# EAGLE design display (EAGLE 5.07)
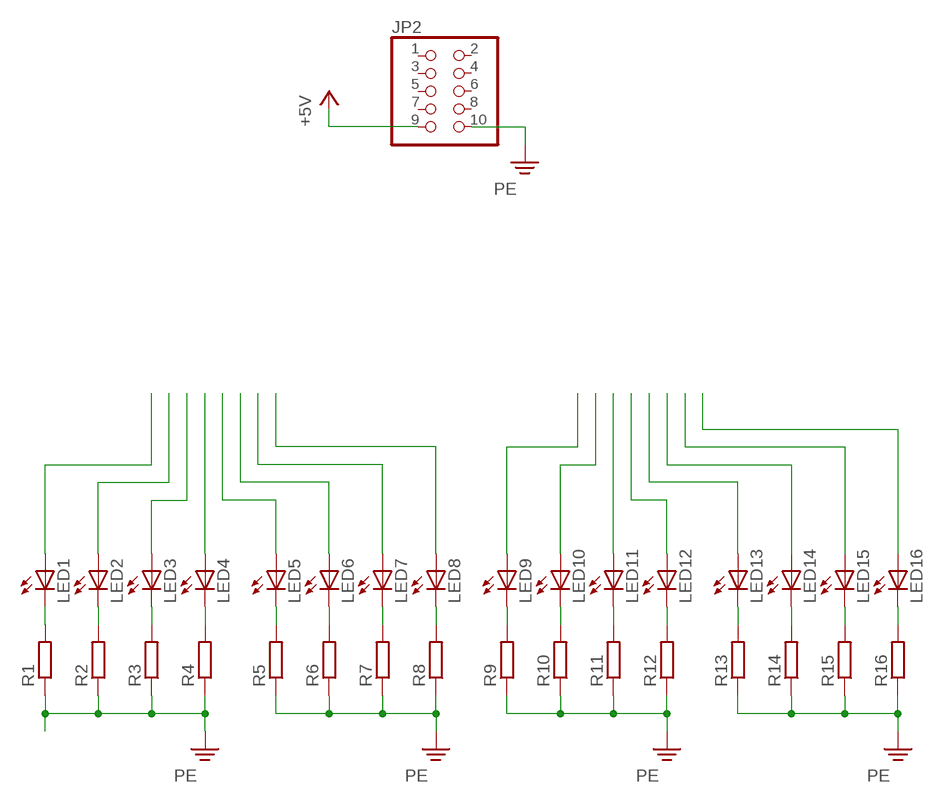
[diagram p0: schematic, sheet 1]

## Parts
JP2  PINHD-2X5  [2X05]
LED1  LED3MM  [LED3MM]
LED2  LED3MM  [LED3MM]
LED3  LED3MM  [LED3MM]
LED4  LED3MM  [LED3MM]
LED5  LED3MM  [LED3MM]
LED6  LED3MM  [LED3MM]
LED7  LED3MM  [LED3MM]
LED8  LED3MM  [LED3MM]
LED9  LED3MM  [LED3MM]
LED10  LED3MM  [LED3MM]
LED11  LED3MM  [LED3MM]
LED12  LED3MM  [LED3MM]
LED13  LED3MM  [LED3MM]
LED14  LED3MM  [LED3MM]
LED15  LED3MM  [LED3MM]
LED16  LED3MM  [LED3MM]
R1  R-EU_0207/10  [0207/10]
R2  R-EU_0207/10  [0207/10]
R3  R-EU_0207/10  [0207/10]
R4  R-EU_0207/10  [0207/10]
R5  R-EU_0207/10  [0207/10]
R6  R-EU_0207/10  [0207/10]
R7  R-EU_0207/10  [0207/10]
R8  R-EU_0207/10  [0207/10]
R9  R-EU_0207/10  [0207/10]
R10  R-EU_0207/10  [0207/10]
R11  R-EU_0207/10  [0207/10]
R12  R-EU_0207/10  [0207/10]
R13  R-EU_0207/10  [0207/10]
R14  R-EU_0207/10  [0207/10]
R15  R-EU_0207/10  [0207/10]
R16  R-EU_0207/10  [0207/10]

## Nets
+5V: JP2.9
N$1: LED1.K(C) R1.2
N$2: LED2.K(C) R2.2
N$5: LED3.K(C) R3.2
N$6: LED4.K(C) R4.2
N$12: LED5.K(C) R5.2
N$13: LED6.K(C) R6.2
N$14: LED7.K(C) R7.2
N$15: LED8.K(C) R8.2
N$17: LED9.K(C) R9.2
N$18: LED10.K(C) R10.2
N$19: LED11.K(C) R11.2
N$20: LED12.K(C) R12.2
N$21: LED13.K(C) R13.2
N$22: LED14.K(C) R14.2
N$23: LED15.K(C) R15.2
N$24: LED16.K(C) R16.2
N$27: LED1.A
N$28: LED2.A
N$29: LED3.A
N$30: LED4.A
N$31: LED5.A
N$32: LED6.A
N$33: LED7.A
N$34: LED8.A
N$35: LED9.A
N$36: LED10.A
N$37: LED11.A
N$38: LED12.A
N$39: LED13.A
N$40: LED14.A
N$41: LED15.A
N$42: LED16.A
PE: JP2.10 R1.1 R2.1 R3.1 R4.1 R5.1 R6.1 R7.1 R8.1 R9.1 R10.1 R11.1 R12.1 R13.1 R14.1 R15.1 R16.1
Unconnected: JP2.1 JP2.2 JP2.3 JP2.4 JP2.5 JP2.6 JP2.7 JP2.8

## Library data of the parts
JP2 = pinhead:PINHD-2X5: PIN HEADER
LED1-LED16 = led:LED: LED OSRAM: - CHIPLED LG R971, LG N971, LY N971, LG Q971, LY Q971, LO R971, LY R971 LH N974, LH R974 LS Q976, LO Q976, LY Q976 LO Q996 - Hyper CHIPLED LW Q18S LB Q993, LB Q99A, LB R99A - SideLED LS A670, LO A670, LY A670, LG A670, LP A670 LB A673, LV A673, LT A673, LW A673 LH A674 LY A675 LS A676, LA A676, LO A676, LY A676, LW A676 LS A679, LY A679, LG A679 - Hyper Micro SIDELED® LS Y876, LA Y876, LO Y876, LY Y876 LT Y87S - SmartLED LW L88C, LW L88S LB L89C, LB L89S, LG L890 LS L89K, LO L89K, LY L89K LS L896, LA L896, LO L896, LY L896 - TOPLED LS T670, LO T670, LY T670, LG T670, LP T670 LSG T670, LSP T670, LSY T670, LOP T670, LYG T670 LG T671, LOG T671, LSG T671 LB T673, LV T673, LT T673, LW T673 LH T674 LS T676, LA T676, LO T676, LY T676, LB T676, LH T676, LSB T676, LW T676 LB T67C, LV T67C, LT T67C, LS T67K, LO T67K, LY T67K, LW E67C LS E67B, LA E67B, LO E67B, LY E67B, LB E67C, LV E67C, LT E67C LW T67C LS T679, LY T679, LG T679 LS T770, LO T770, LY T770, LG T770, LP T770 LB T773, LV T773, LT T773, LW T773 LH T774 LS E675, LA E675, LY E675, LS T675 LS T776, LA T776, LO T776, LY T776, LB T776 LHGB T686 LT T68C, LB T68C - Hyper Mini TOPLED® LB M676 - Mini TOPLED Santana® LG M470 LS M47K, LO M47K, LY M47K Source: http://www.osram.convergy.de LUXEON: - LUMILED® LXK2-PW12-R00, LXK2-PW12-S00, LXK2-PW14-U00, LXK2-PW14-V00 LXK2-PM12-R00, LXK2-PM12-S00, LXK2-PM14-U00 LXK2-PE12-Q00, LXK2-PE12-R00, LXK2-PE12-S00, LXK2-PE14-T00, LXK2-PE14-U00 LXK2-PB12-K00, LXK2-PB12-L00, LXK2-PB12-M00, LXK2-PB14-N00, LXK2-PB14-P00, LXK2-PB14-Q00 LXK2-PR12-L00, LXK2-PR12-M00, LXK2-PR14-Q00, LXK2-PR14-R00 LXK2-PD12-Q00, LXK2-PD12-R00, LXK2-PD12-S00 LXK2-PH12-R00, LXK2-PH12-S00 LXK2-PL12-P00, LXK2-PL12-Q00, LXK2-PL12-R00 Source: www.luxeon.com KINGBRIGHT: KA-3528ASYC Source: www.kingbright.com
R1-R16 = rcl:R-EU_: RESISTOR, European symbol

## Board
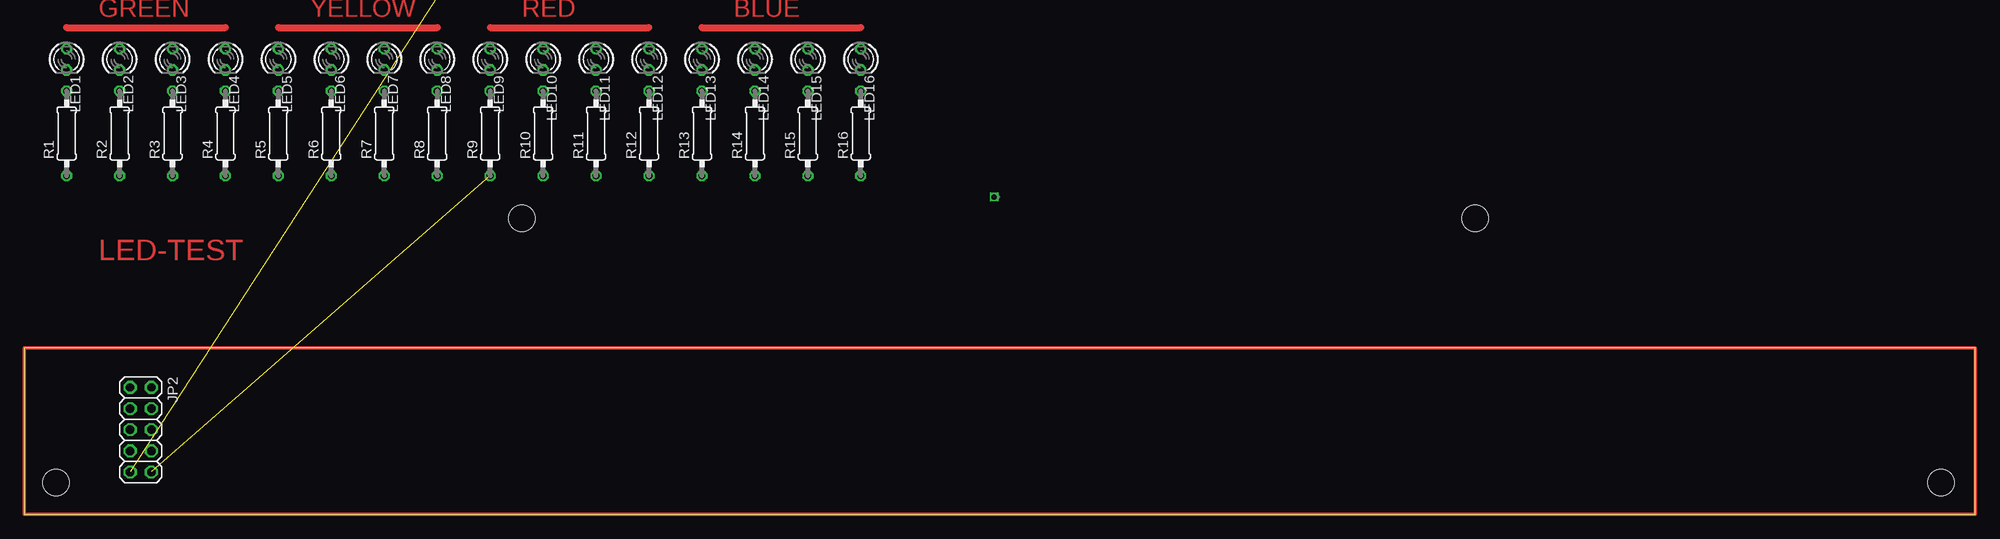
[diagram p1: board, top side]
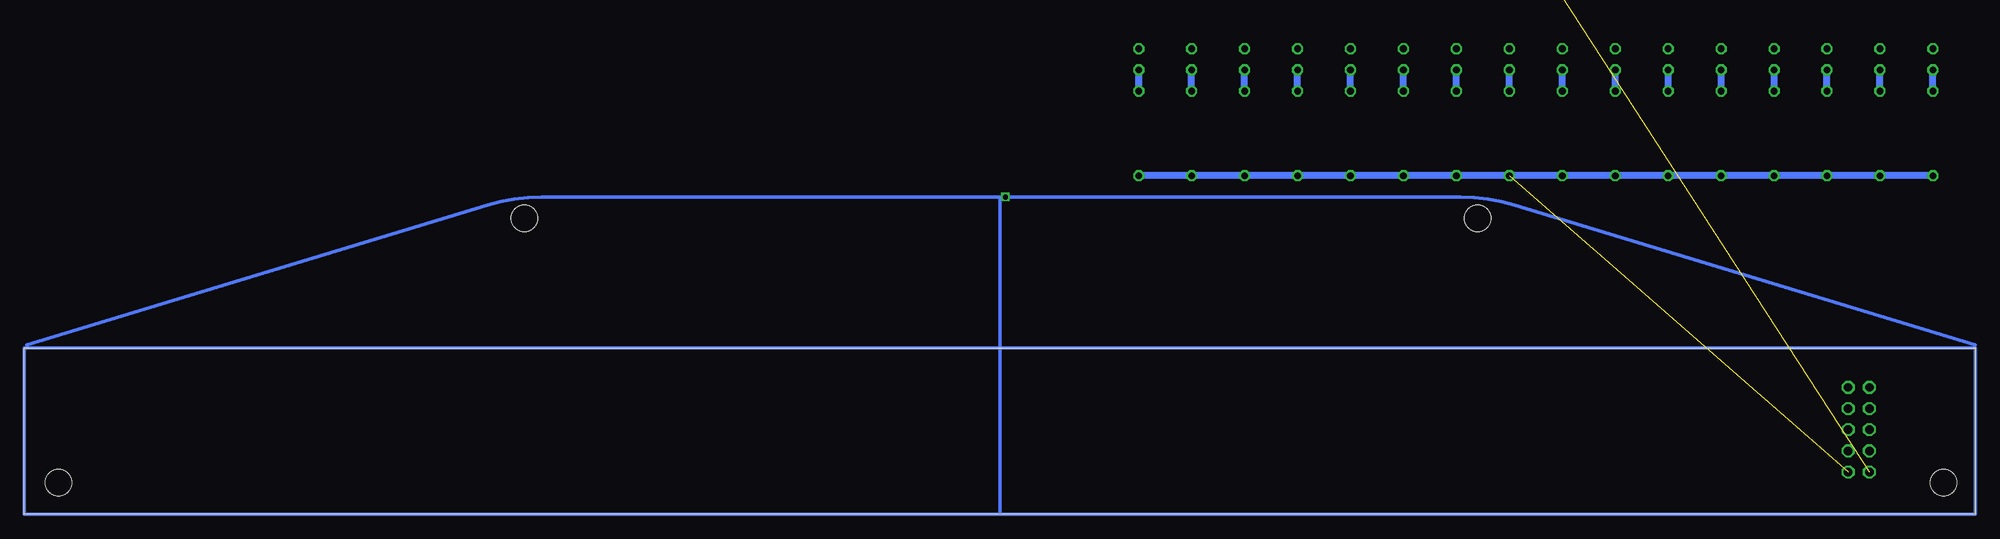
[diagram p2: board, bottom side, seen from below]

Size 234 x 20 mm. Coordinates in mm from the lower left corner, seen from the top.
Outline: 0,0 234,0 234,20 0,20 0,0
Copper layers (1*16): Top 0.035mm / dielectric 1.5mm / Bottom 0.035mm
Design rules "default": minimum track width 10mil, minimum drill 24mil, track to track 8mil, track to pad 8mil, pad to pad 8mil, via to via 8mil, smd to smd 8mil, copper to edge 40mil, drill to drill 8mil, minimum pad ring 10mil, minimum via ring 8mil, stop-mask expansion 4mil, vias tented up to drill 0mil, thermal gap 10mil
Holes 3.2 mm at 3.81,3.81 59.69,35.56 173.99,35.56 229.87,3.81

### Footprints (pad centres in the part's own frame; a part is rotated, then mirrored left to right if it is on the bottom)
2X05 = drill 1.016 octagon: 1 -5.08,-1.27; 2 -5.08,1.27; 3 -2.54,-1.27; 4 -2.54,1.27; 5 0,-1.27; 6 0,1.27; 7 2.54,-1.27; 8 2.54,1.27; 9 5.08,-1.27; 10 5.08,1.27
LED3MM = drill 0.813 octagon: A -1.27,0; K 1.27,0
0207/10 = drill 0.813 octagon: 1 -5.08,0; 2 5.08,0

### Placement (x,y rotation side)
JP2  13.97,10.16 270 top
LED1  5.08,54.61 270 top  (outside the outline)
LED2  11.43,54.61 270 top  (outside the outline)
LED3  17.78,54.61 270 top  (outside the outline)
LED4  24.13,54.61 270 top  (outside the outline)
LED5  30.48,54.61 270 top  (outside the outline)
LED6  36.83,54.61 270 top  (outside the outline)
LED7  43.18,54.61 270 top  (outside the outline)
LED8  49.53,54.61 270 top  (outside the outline)
LED9  55.88,54.61 270 top  (outside the outline)
LED10  62.23,54.61 270 top  (outside the outline)
LED11  68.58,54.61 270 top  (outside the outline)
LED12  74.93,54.61 270 top  (outside the outline)
LED13  81.28,54.61 270 top  (outside the outline)
LED14  87.63,54.61 270 top  (outside the outline)
LED15  93.98,54.61 270 top  (outside the outline)
LED16  100.33,54.61 270 top  (outside the outline)
R1  5.08,45.72 90 top  (outside the outline)
R2  11.43,45.72 90 top  (outside the outline)
R3  17.78,45.72 90 top  (outside the outline)
R4  24.13,45.72 90 top  (outside the outline)
R5  30.48,45.72 90 top  (outside the outline)
R6  36.83,45.72 90 top  (outside the outline)
R7  43.18,45.72 90 top  (outside the outline)
R8  49.53,45.72 90 top  (outside the outline)
R9  55.88,45.72 90 top  (outside the outline)
R10  62.23,45.72 90 top  (outside the outline)
R11  68.58,45.72 90 top  (outside the outline)
R12  74.93,45.72 90 top  (outside the outline)
R13  81.28,45.72 90 top  (outside the outline)
R14  87.63,45.72 90 top  (outside the outline)
R15  93.98,45.72 90 top  (outside the outline)
R16  100.33,45.72 90 top  (outside the outline)

### Tracks (layer width: path | path; a pad name or v marks a point on that pad's centre or on a via)
+5V  (1 unrouted)
N$1
  Bottom 0.813: R1.2 LED1.K
N$2
  Bottom 0.813: R2.2 LED2.K
N$5
  Bottom 0.813: R3.2 LED3.K
N$6
  Bottom 0.813: R4.2 LED4.K
N$9
  Top 0.813: 5.08,58.42 24.13,58.42
N$10
  Bottom 0.406: 107.95,0 0,0 0,20 234,20 234,0 117,0 | 107.95,0 117,0 | 107.95,0 117,0 | 117,0 117,38
N$11
  Top 0.406: 234,20 0,20 0,0 234,0 234,20
N$12
  Bottom 0.813: R5.2 LED5.K
N$13
  Bottom 0.813: R6.2 LED6.K
N$14
  Bottom 0.813: R7.2 LED7.K
N$15
  Bottom 0.813: R8.2 LED8.K
N$16
  Top 0.813: 30.48,58.42 49.53,58.42
N$17
  Bottom 0.813: R9.2 LED9.K
N$18
  Bottom 0.813: R10.2 LED10.K
N$19
  Bottom 0.813: R11.2 LED11.K
N$20
  Bottom 0.813: R12.2 LED12.K
N$21
  Bottom 0.813: R13.2 LED13.K
N$22
  Bottom 0.813: R14.2 LED14.K
N$23
  Bottom 0.813: R15.2 LED15.K
N$24
  Bottom 0.813: R16.2 LED16.K
N$25
  Top 0.813: 55.88,58.42 74.93,58.42
N$26
  Top 0.813: 81.28,58.42 100.33,58.42
N$43
  Bottom 0.406: 234,0 234,20
N$44
  Bottom 0.406: 233.68,20.32 178.42,37.14 arc17 171.95,38.1 117.34,38.1 | 117.34,38.1 116.84,38.1 117.34,38.1
N$46  (via drill 0.6)
  Top 0.406: v116.34,38.1 116.84,38.1 v116.34,38.1
  Bottom 0.406: 0,20.32 55.26,37.14 arc-17 61.73,38.1 v116.34,38.1
PE  (1 unrouted)
  Bottom 0.813: R1.1 R2.1 R3.1 R4.1 R5.1 R6.1 R7.1 R8.1 R9.1 R10.1 R11.1 R12.1 R13.1 R14.1 R15.1 R16.1
(copper drawn outside any net)
  shapes: Bottom circle x4, Top circle x4

### Text on the board
Top: GREEN | YELLOW | RED | BLUE | LED-TEST